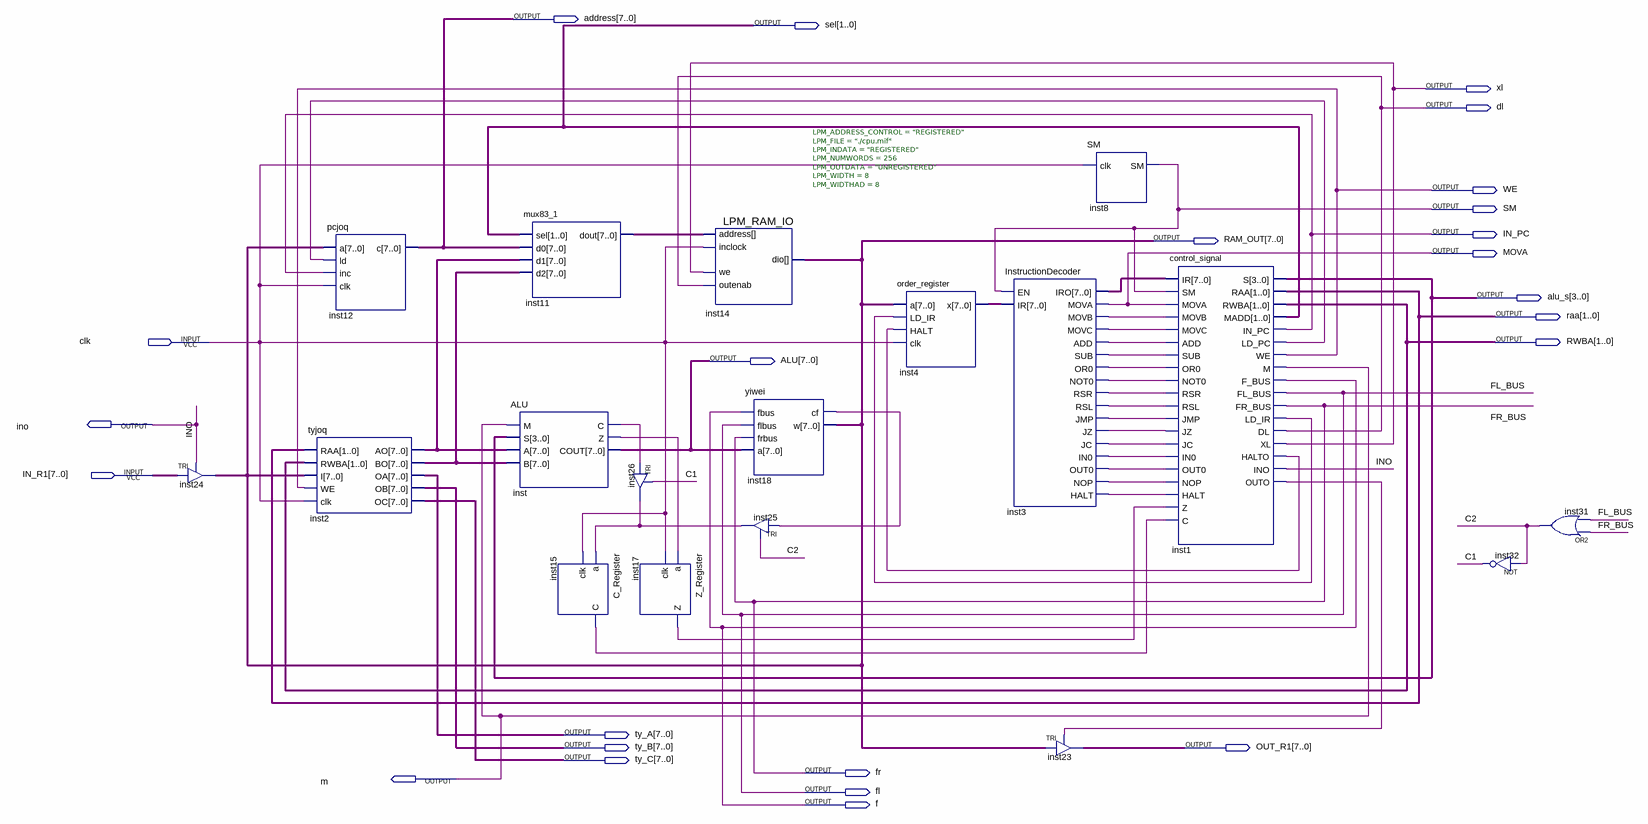
[diagram p0: schematic sheet]
// Quartus schematic CPU.bdf as structural Verilog: 18 symbols, 24 pins
module CPU (
  input  clk,
  input  [7:0] IN_R1,
  output [7:0] address,
  output [1:0] sel,
  output xl,
  output dl,
  output WE,
  output SM,
  output IN_PC,
  output [7:0] RAM_OUT,
  output MOVA,
  output [3:0] alu_s,
  output [1:0] raa,
  output [1:0] RWBA,
  output [7:0] ALU,
  output ino,
  output [7:0] ty_A,
  output [7:0] ty_B,
  output [7:0] OUT_R1,
  output [7:0] ty_C,
  output fr,
  output m,
  output fl,
  output f
);

  wire C1, C2, inst1_halto, inst1_ld_ir, inst1_ld_pc, inst1_outo, inst3_add, inst3_halt, inst3_in0, inst3_jc,
       inst3_jmp, inst3_jz, inst3_movb, inst3_movc, inst3_nop, inst3_not0, inst3_or0, inst3_out0, inst3_rsl,
       inst3_rsr, inst3_sub, inst15_c, inst17_z, inst18_cf, inst26_out, inst_c, inst_z;
  wire [7:0] inst2_ao, inst2_bo, inst3_iro, inst4_x, inst11_dout;

  TRI inst24[7:0] (.IN(IN_R1), .OE(ino), .OUT(RAM_OUT));
  pcjoq inst12 (.a(RAM_OUT), .ld(inst1_ld_pc), .inc(IN_PC), .clk(clk), .c(address));
  tyjoq inst2 (
    .RAA(raa), .RWBA(RWBA), .I(RAM_OUT), .WE(WE), .clk(clk), .AO(inst2_ao), .BO(inst2_bo), .OA(ty_A),
    .OB(ty_B), .OC(ty_C));
  mux83_1 inst11 (.sel(sel), .d0(address), .d1(inst2_ao), .d2(inst2_bo), .dout(inst11_dout));
  ALU inst (.M(m), .S(alu_s), .A(inst2_ao), .B(inst2_bo), .C(inst_c), .Z(inst_z), .COUT(ALU));
  C_Register inst15 (.a(inst26_out), .clk(clk), .C(inst15_c));
  TRI inst26 (.IN(inst_c), .OE(C1), .OUT(inst26_out));
  Z_Register inst17 (.a(inst_z), .clk(clk), .Z(inst17_z));
  LPM_RAM_IO #(.LPM_ADDRESS_CONTROL("REGISTERED"), .LPM_FILE("./cpu.mif"), .LPM_INDATA("REGISTERED"), .LPM_NUMWORDS(256), .LPM_OUTDATA("UNREGISTERED"), .LPM_WIDTH(8), .LPM_WIDTHAD(8)) inst14 (
    .address(inst11_dout), .inclock(clk), .we(xl), .outenab(dl), .dio(RAM_OUT));
  yiwei inst18 (.fbus(f), .flbus(fl), .frbus(fr), .a(ALU), .cf(inst18_cf), .w(RAM_OUT));
  TRI inst25 (.IN(inst18_cf), .OE(C2), .OUT(inst26_out));
  order_register inst4 (.a(RAM_OUT), .LD_IR(inst1_ld_ir), .HALT(inst1_halto), .clk(clk), .x(inst4_x));
  InstructionDecoder inst3 (
    .EN(SM), .IR(inst4_x), .IRO(inst3_iro), .MOVA(MOVA), .MOVB(inst3_movb), .MOVC(inst3_movc),
    .ADD(inst3_add), .SUB(inst3_sub), .OR0(inst3_or0), .NOT0(inst3_not0), .RSR(inst3_rsr), .RSL(inst3_rsl),
    .JMP(inst3_jmp), .JZ(inst3_jz), .JC(inst3_jc), .IN0(inst3_in0), .OUT0(inst3_out0), .NOP(inst3_nop),
    .HALT(inst3_halt));
  SM inst8 (.clk(clk), .SM(SM));
  TRI inst23[7:0] (.IN(RAM_OUT), .OE(inst1_outo), .OUT(OUT_R1));
  control_signal inst1 (
    .IR(inst3_iro), .SM(SM), .MOVA(MOVA), .MOVB(inst3_movb), .MOVC(inst3_movc), .ADD(inst3_add),
    .SUB(inst3_sub), .OR0(inst3_or0), .NOT0(inst3_not0), .RSR(inst3_rsr), .RSL(inst3_rsl), .JMP(inst3_jmp),
    .JZ(inst3_jz), .JC(inst3_jc), .IN0(inst3_in0), .OUT0(inst3_out0), .NOP(inst3_nop), .HALT(inst3_halt),
    .Z(inst17_z), .C(inst15_c), .S(alu_s), .RAA(raa), .RWBA(RWBA), .MADD(sel), .IN_PC(IN_PC),
    .LD_PC(inst1_ld_pc), .WE(WE), .M(m), .F_BUS(f), .FL_BUS(fl), .FR_BUS(fr), .LD_IR(inst1_ld_ir), .DL(dl),
    .XL(xl), .HALTO(inst1_halto), .INO(ino), .OUTO(inst1_outo));
  not inst32 (C1, C2);
  or inst31 (C2, fr, fl);

  // Other names for the same wires on the sheet: FL_BUS = fl; FR_BUS = fr
endmodule
